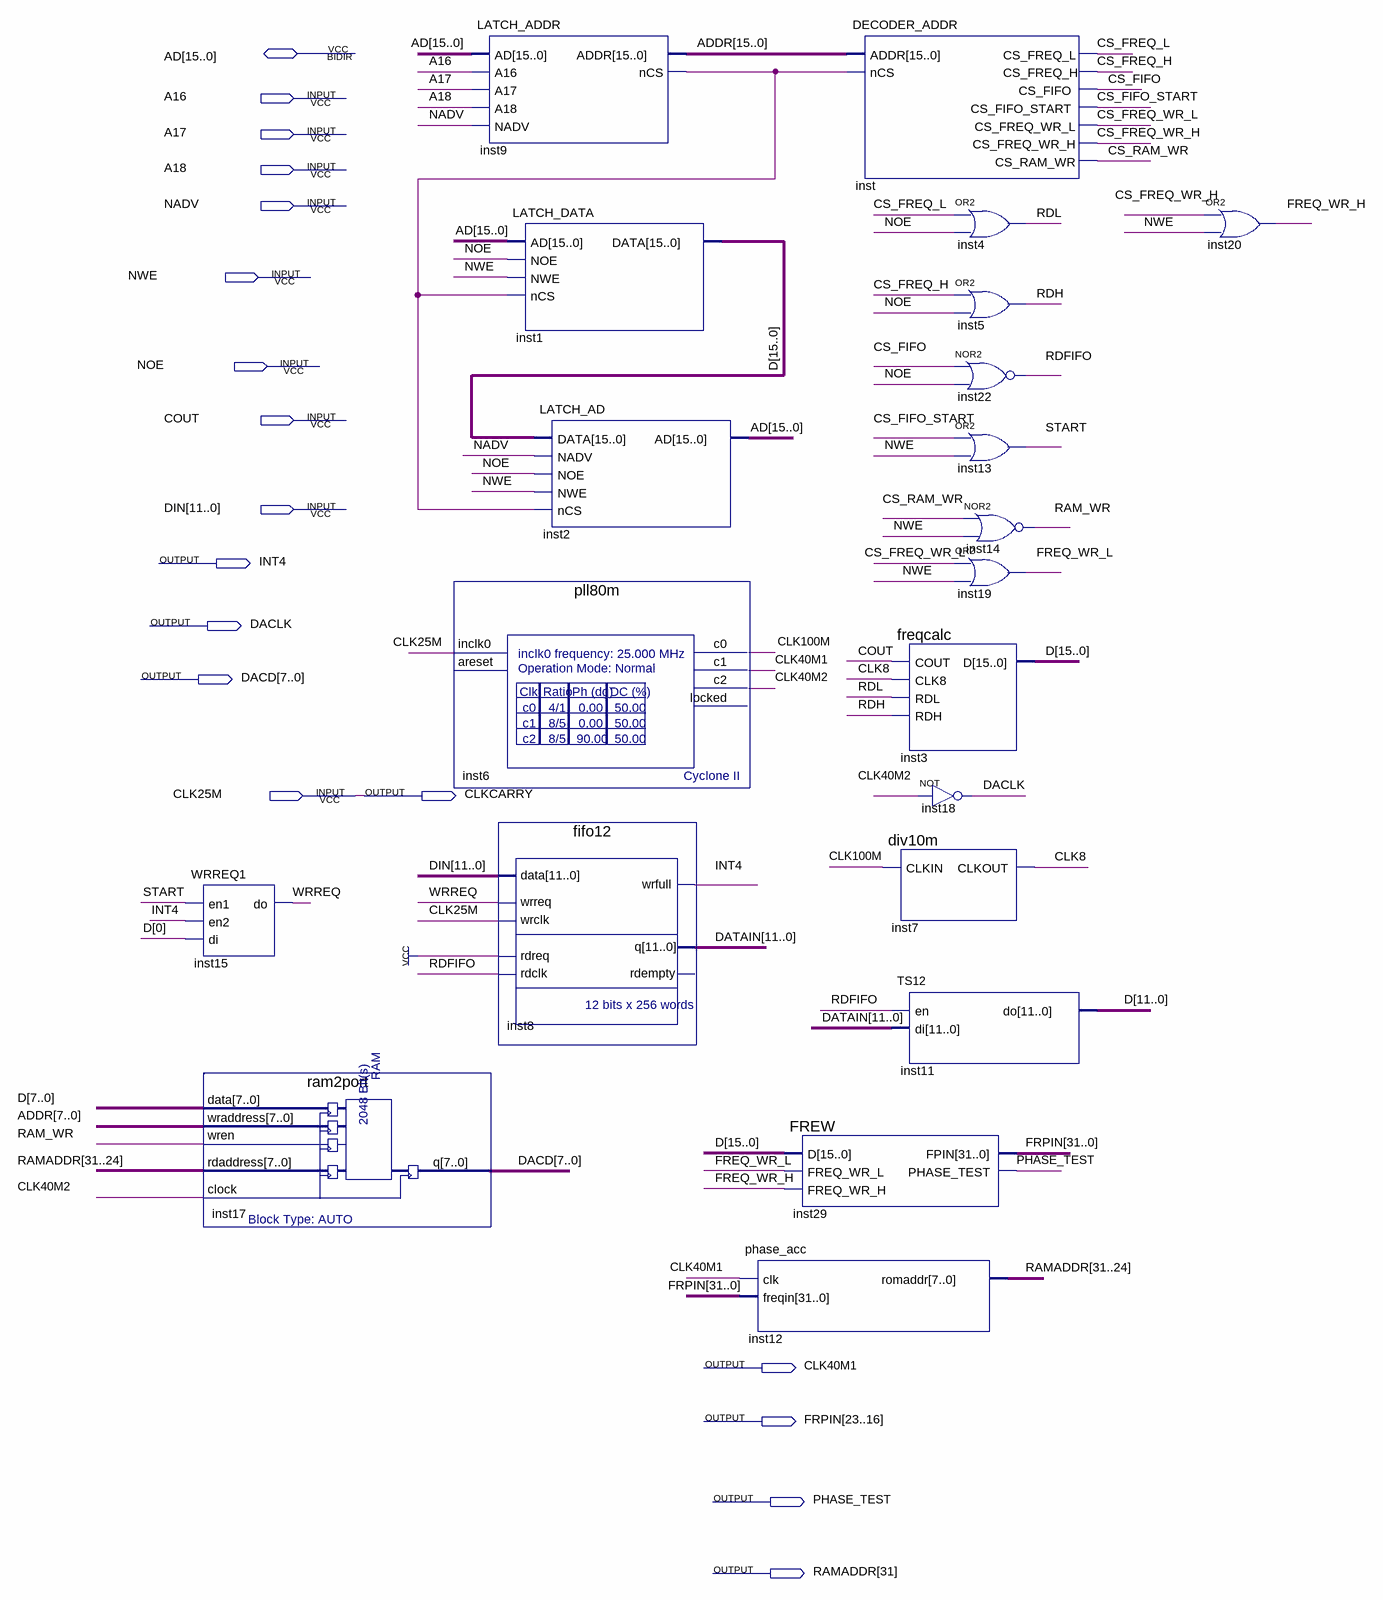
[diagram p0: schematic sheet]
// Quartus schematic FPGACONTROL.bdf as structural Verilog: 21 symbols, 18 pins
module FPGACONTROL (
  input  A16,
  input  A17,
  input  A18,
  input  NADV,
  input  NWE,
  input  NOE,
  input  COUT,
  input  [11:0] DIN,
  input  CLK25M,
  inout  [15:0] AD,
  output INT4,
  output DACLK,
  output [7:0] DACD,
  output CLKCARRY,
  output CLK40M1,
  output [31:0] FRPIN,
  output PHASE_TEST,
  output [31:24] RAMADDR
);

  wire CLK8, CLK40M2, CLK100M, CS_FIFO, CS_FIFO_START, CS_FREQ_H, CS_FREQ_L, CS_FREQ_WR_H, CS_FREQ_WR_L,
       CS_RAM_WR, FREQ_WR_H, FREQ_WR_L, inst9_ncs, RAM_WR, RDFIFO, RDH, RDL, START, WRREQ;
  wire [11:0] DATAIN;
  wire [15:0] ADDR, D;

  WRREQ1 inst15 (.en1(START), .en2(INT4), .di(D[0]), .\do (WRREQ));
  ram2port inst17 (.data(D[7:0]), .wraddress(ADDR[7:0]), .wren(RAM_WR), .rdaddress(RAMADDR), .clock(CLK40M2), .q(DACD));
  pll80m inst6 (.inclk0(CLK25M), .c0(CLK100M), .c1(CLK40M1), .c2(CLK40M2));  // open: areset, locked
  LATCH_ADDR inst9 (.AD(AD), .A16(A16), .A17(A17), .A18(A18), .NADV(NADV), .ADDR(ADDR), .nCS(inst9_ncs));
  LATCH_DATA inst1 (.AD(AD), .NOE(NOE), .NWE(NWE), .nCS(inst9_ncs), .DATA(D));
  LATCH_AD inst2 (.DATA(D), .NADV(NADV), .NOE(NOE), .NWE(NWE), .nCS(inst9_ncs), .AD(AD));
  fifo12 inst8 (
    .data(DIN), .wrreq(WRREQ), .wrclk(CLK25M), .rdreq(1'b1), .rdclk(RDFIFO), .wrfull(INT4), .q(DATAIN));  // open: rdempty
  phase_acc inst12 (.clk(CLK40M1), .freqin(FRPIN), .romaddr(RAMADDR));
  FREW inst29 (.D(D), .FREQ_WR_L(FREQ_WR_L), .FREQ_WR_H(FREQ_WR_H), .FPIN(FRPIN), .PHASE_TEST(PHASE_TEST));
  DECODER_ADDR inst (
    .ADDR(ADDR), .nCS(inst9_ncs), .CS_FREQ_L(CS_FREQ_L), .CS_FREQ_H(CS_FREQ_H), .CS_FIFO(CS_FIFO),
    .CS_FIFO_START(CS_FIFO_START), .CS_FREQ_WR_L(CS_FREQ_WR_L), .CS_FREQ_WR_H(CS_FREQ_WR_H),
    .CS_RAM_WR(CS_RAM_WR));
  freqcalc inst3 (.COUT(COUT), .CLK8(CLK8), .RDL(RDL), .RDH(RDH), .D(D));
  div10m inst7 (.CLKIN(CLK100M), .CLKOUT(CLK8));
  TS12 inst11 (.en(RDFIFO), .di(DATAIN), .\do (D[11:0]));
  or inst4 (RDL, CS_FREQ_L, NOE);
  or inst5 (RDH, CS_FREQ_H, NOE);
  nor inst22 (RDFIFO, CS_FIFO, NOE);
  or inst13 (START, CS_FIFO_START, NWE);
  nor inst14 (RAM_WR, CS_RAM_WR, NWE);
  or inst19 (FREQ_WR_L, CS_FREQ_WR_L, NWE);
  not inst18 (DACLK, CLK40M2);
  or inst20 (FREQ_WR_H, CS_FREQ_WR_H, NWE);

  assign CLKCARRY = CLK25M;
endmodule
